# EAGLE design bp2ng (EAGLE 7.2.0)
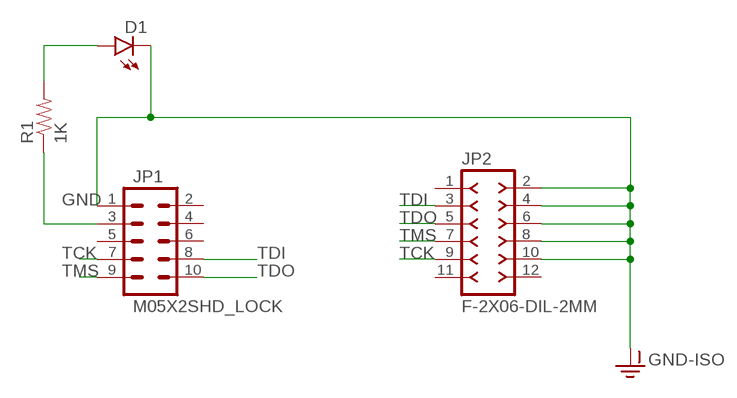
[diagram p0: schematic, sheet 1]

## Parts
D1  LED1206  [LED-1206]
JP1  M05X2SHD_LOCK  [2X5-SHROUDED_LOCK]
JP2  F-2X06-DIL-2MM  [DIL-2MM-2X06]
R1  1K  RESISTOR1206  [1206]

## Nets
GND: D1.C JP1.1 JP2.2 JP2.4 JP2.6 JP2.8 JP2.10 ; supply symbol labelled GND-ISO
N$1: D1.A R1.2
N$2: JP1.3 R1.1
TCK: JP1.7 JP2.9
TDI: JP1.8 JP2.3
TDO: JP1.10 JP2.5
TMS: JP1.9 JP2.7
Unconnected: JP1.2 JP1.4 JP1.5 JP1.6 JP2.1 JP2.11 JP2.12

## Library data of the parts
D1 = SparkFun-LED:LED: LEDs Standard schematic elements and footprints for 5mm, 3mm, 1206, and 0603 sized LEDs. 5mm - Spark Fun Electronics SKU : COM-00529 (and others)
JP1 = SparkFun-Connectors:M05X2: Header 5x2 Standard 10-pin dual row 0.1" header. Commonly used with AVR-ISP. Use with Spark Fun Electronics SKU: PRT-00778
JP2 = con-headers-jp:F-2X06-: FEMALE HEADER
R1 = SparkFun-Passives:RESISTOR: Resistor Basic schematic elements and footprints for 0603, 1206, and PTH resistors.

## Board
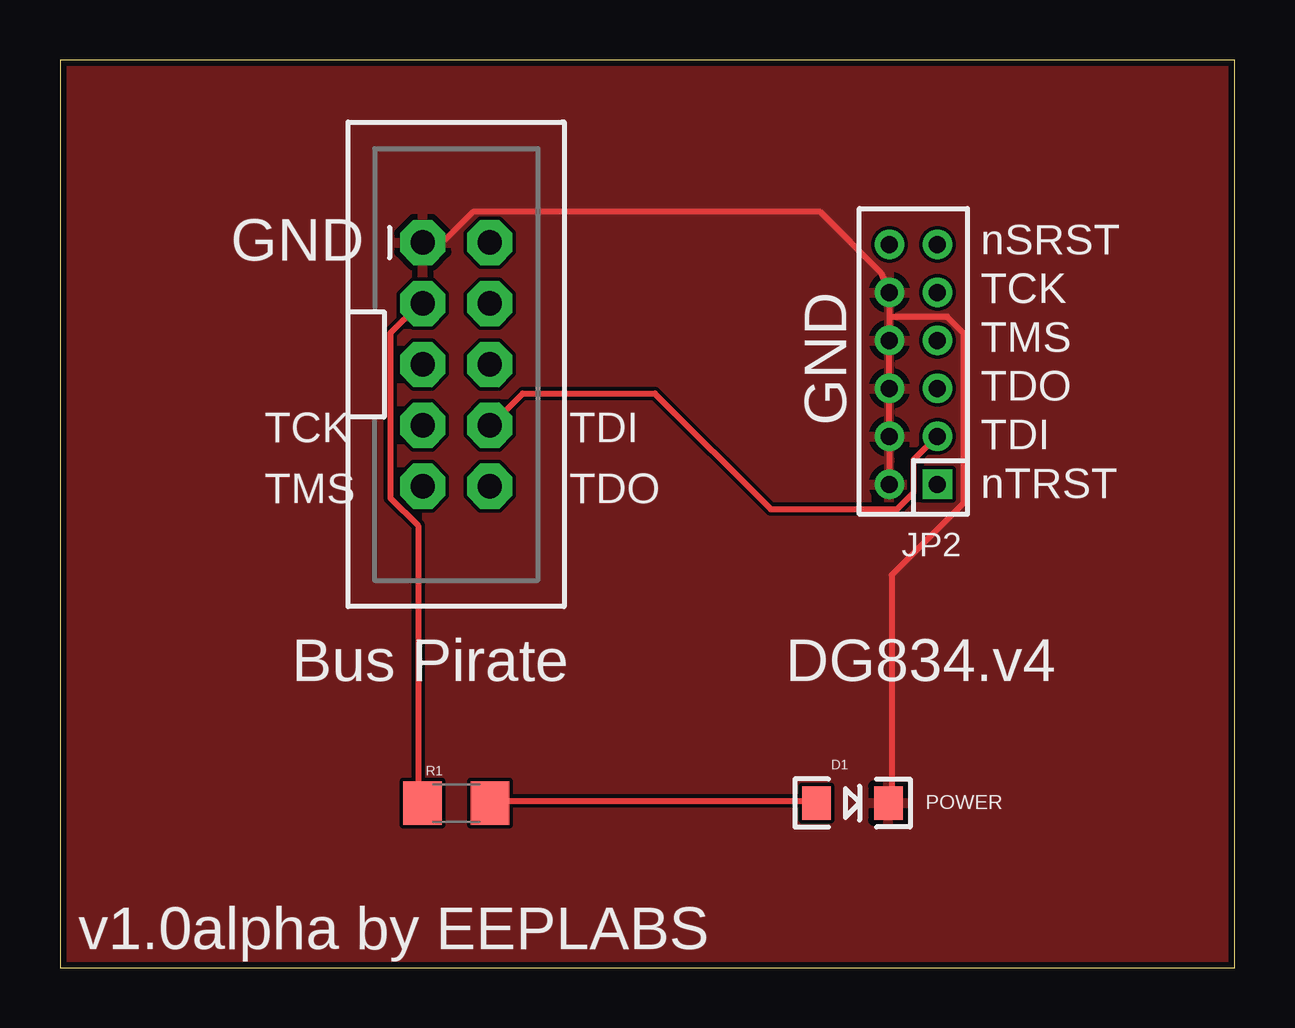
[diagram p1: board, top side]
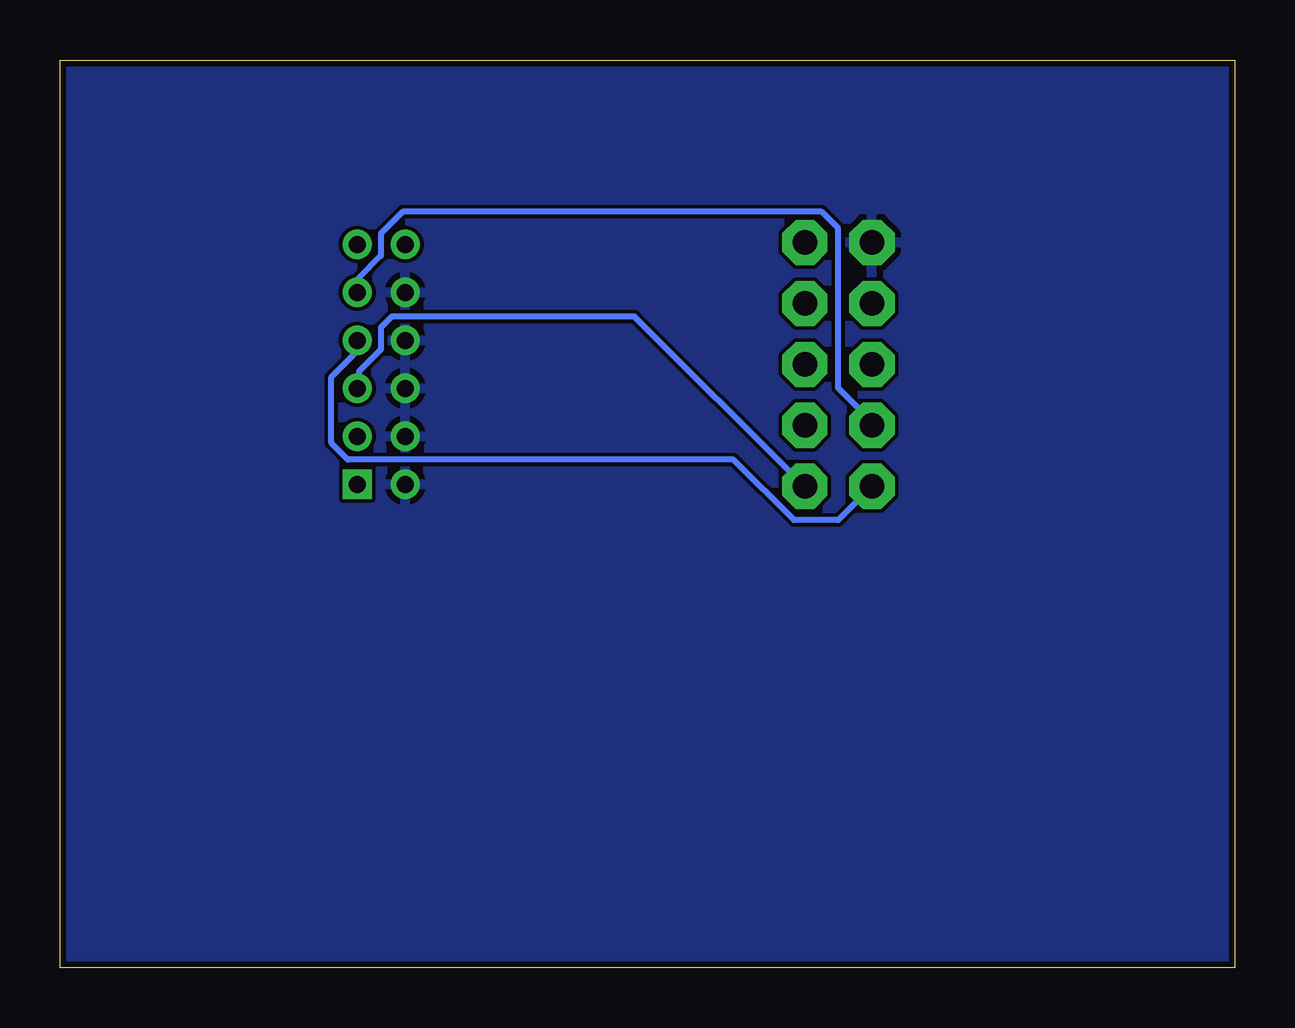
[diagram p2: board, bottom side, seen from below]

Size 48.95 x 37.84 mm. Coordinates in mm from the lower left corner, seen from the top.
Outline: 0,0 48.95,0 48.95,37.84 0,37.84 0,0
Copper layers (1*16): Top 0.035mm / dielectric 1.5mm / Bottom 0.035mm
Design rules "SeeedStudio_2layer_DRU_no_angle_20140221": minimum track width 6mil, minimum drill 12mil, track to track 6mil, track to pad 6mil, pad to pad 6mil, via to via 6mil, smd to smd 0mil, copper to edge 10mil, drill to drill 10mil, minimum pad ring 10mil, minimum via ring 6mil, stop-mask expansion 2mil, vias tented up to drill 100mil, thermal gap 10mil

### Footprints (pad centres in the part's own frame; a part is rotated, then mirrored left to right if it is on the bottom)
LED-1206 = smd 1.2 x 1.4: A -1.5,0; C 1.5,0
2X5-SHROUDED_LOCK = drill 1.016 pad 1.88 octagon: 1 -1.397,5.08; 2 1.397,5.08; 3 -1.397,2.54; 4 1.397,2.54; 5 -1.397,0; 6 1.397,0; 7 -1.397,-2.54; 8 1.397,-2.54; 9 -1.397,-5.08; 10 1.397,-5.08
DIL-2MM-2X06 = drill 0.711 square: 1 -5,-1 | drill 0.711: 2 -5,1; 3 -3,-1; 4 -3,1; 5 -1,-1; 6 -1,1; 7 1,-1; 8 1,1; 9 3,-1; 10 3,1; 11 5,-1; 12 5,1
1206 = smd 1.6 x 1.8: 1 -1.4,0; 2 1.4,0

### Placement (x,y rotation side)
D1  33.02,6.86 0 top
JP1  16.51,25.15 0 top
JP2  35.56,25.15 90 top
R1  16.51,6.86 0 top

### Tracks (layer width: path | path; a pad name or v marks a point on that pad's centre or on a via)
GND
  Top 0.254: 34.56,27.14 JP2.10 34.2,28.98 31.67,31.5 17.21,31.5 16.07,30.36 15.15,30.36 JP1.1 | 34.56,27.14 JP2.8 JP2.6 JP2.4 JP2.2 | 34.56,27.14 36.95,27.14 37.64,26.46 37.64,19.34 34.65,16.36 34.65,6.95 D1.C
  pour Top: 0.25,37.85 49.02,37.85 49.02,0 0.25,0
  pour Bottom: 0,37.85 49.02,37.85 49.02,0 0,0
N$1
  Top 0.254: D1.A 31.44,6.95 18.13,6.95 R1.2
N$2
  Top 0.254: R1.1 14.92,6.95 14.92,18.42 13.77,19.57 13.77,26.46 14.92,27.6 JP1.3
TCK
  Bottom 0.254: JP2.9 36.49,28.29 36.49,28.75 35.57,29.67 35.57,30.59 34.65,31.5 17.21,31.5 16.52,30.82 16.52,24.16 15.15,22.78 JP1.7
TDI
  Top 0.254: JP2.3 36.49,22.1 35.57,21.18 35.57,19.8 34.88,19.11 29.61,19.11 24.79,23.93 19.28,23.93 18.13,22.78 JP1.8
TDO
  Bottom 0.254: 36.72,23.7 JP2.5 36.49,24.16 36.49,24.85 35.57,25.77 35.57,26.69 35.11,27.14 25.02,27.14 18.13,20.26 JP1.10
TMS
  Bottom 0.254: JP2.7 36.72,26 36.72,25.54 37.64,24.62 37.64,21.87 36.95,21.18 20.88,21.18 18.36,18.65 16.52,18.65 15.15,20.03 JP1.9

### Text on the board
tPlace: GND | nSRST | TCK | TMS | TDO | GND | TCK | TDI | TDI | TMS | TDO | nTRST | Bus Pirate | DG834.v4 | POWER | v1.0alpha by EEPLABS